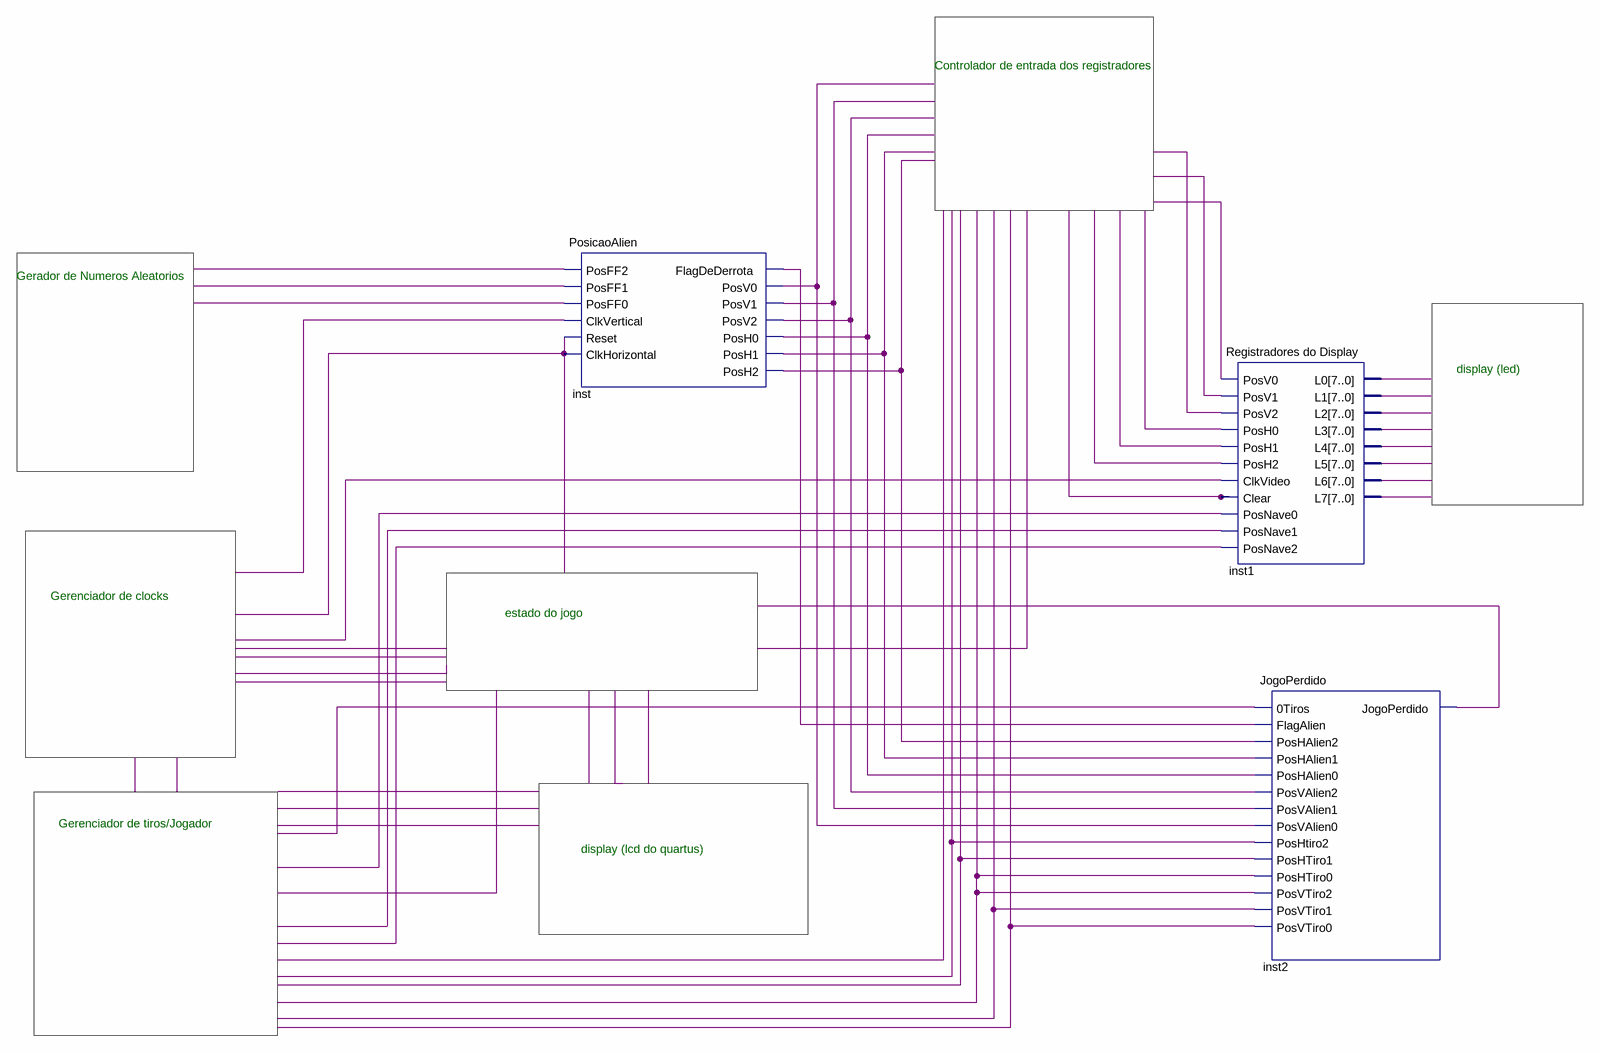
[diagram p0: schematic sheet]
// Quartus schematic Diagrama do que tem de ser feito.bdf as structural Verilog: 3 symbols, 0 pins
module \Diagrama_do_que_tem_de_ser_feito  (
);

  wire inst1_l0, inst1_l1, inst1_l2, inst1_l3, inst1_l4, inst1_l5, inst1_l6, inst1_l7, inst2_jogoperdido,
       inst_flagdederrota, inst_posh0, inst_posh1, inst_posh2, inst_posv0, inst_posv1, inst_posv2, undriven,
       undriven_2, undriven_3, undriven_4, undriven_5, undriven_6, undriven_7, undriven_8, undriven_9,
       undriven_10, undriven_11, undriven_12, undriven_13, undriven_14, undriven_15, undriven_16,
       undriven_17, undriven_18, undriven_19, undriven_20, undriven_21, undriven_22;

  PosicaoAlien inst (
    .PosFF2(undriven), .PosFF1(undriven_2), .PosFF0(undriven_3), .ClkVertical(undriven_4),
    .Reset(undriven_5), .ClkHorizontal(undriven_5), .FlagDeDerrota(inst_flagdederrota), .PosV0(inst_posv0),
    .PosV1(inst_posv1), .PosV2(inst_posv2), .PosH0(inst_posh0), .PosH1(inst_posh1), .PosH2(inst_posh2));
  \Registradores_do_Display  inst1 (
    .PosV0(undriven_10), .PosV1(undriven_11), .PosV2(undriven_12), .PosH0(undriven_13), .PosH1(undriven_14),
    .PosH2(undriven_15), .ClkVideo(undriven_6), .Clear(undriven_16), .PosNave0(undriven_7),
    .PosNave1(undriven_8), .PosNave2(undriven_9), .L0(inst1_l0), .L1(inst1_l1), .L2(inst1_l2), .L3(inst1_l3),
    .L4(inst1_l4), .L5(inst1_l5), .L6(inst1_l6), .L7(inst1_l7));
  JogoPerdido inst2 (
    .\0Tiros (undriven_17), .FlagAlien(inst_flagdederrota), .PosHAlien2(inst_posh2), .PosHAlien1(inst_posh1),
    .PosHAlien0(inst_posh0), .PosVAlien2(inst_posv2), .PosVAlien1(inst_posv1), .PosVAlien0(inst_posv0),
    .PosHtiro2(undriven_22), .PosHTiro1(undriven_21), .PosHTiro0(undriven_20), .PosVTiro2(undriven_20),
    .PosVTiro1(undriven_19), .PosVTiro0(undriven_18), .JogoPerdido(inst2_jogoperdido));

  // Notes on the sheet:
  //   Controlador de entrada dos registradores
  //   Gerador de Numeros Aleatorios
  //   display (led)
  //   Gerenciador de clocks
  //   estado do jogo
  //   Gerenciador de tiros/Jogador
  //   display (lcd do quartus)
endmodule
